# Altium schematic sheet spw_iso.SchDoc
size 209 x 297 mm; SheetNumber: 11; SheetTotal: 12
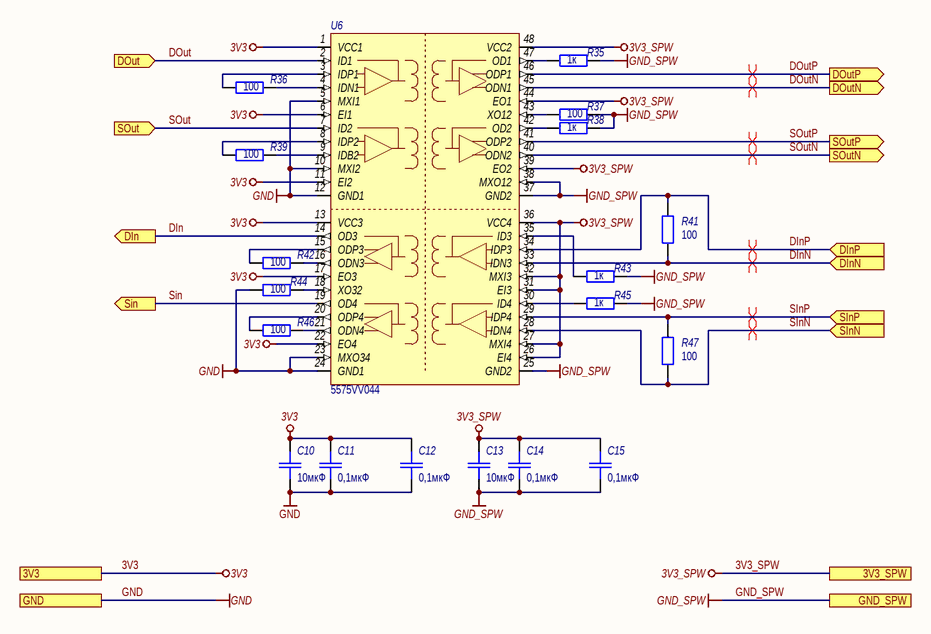
[diagram p0: spw_iso.SchDoc]

## Parts
C10  10мкФ  [SMD_C0805]
C11  0,1мкФ  [SMD_C0805]
C12  0,1мкФ  [SMD_C0805]
C13  10мкФ  [SMD_C0805]
C14  0,1мкФ  [SMD_C0805]
C15  0,1мкФ  [SMD_C0805]
R35  1к  [SMD_0805]
R36  100  [SMD_0805]
R37  100  [SMD_0805]
R38  1к  [SMD_0805]
R39  100  [SMD_0805]
R41  100  [SMD_0805]
R42  100  [SMD_0805]
R43  1к  [SMD_0805]
R44  100  [SMD_0805]
R45  1к  [SMD_0805]
R46  100  [SMD_0805]
R47  100  [SMD_0805]
U6  5575VV044  [MK 4159.48-1]

## Ports
3V3, 3V3_SPW, DIn (out), DInN (in), DInP (in), DOut (in), DOutN (out), DOutP (out), GND, GND_SPW, Sin (out), SInN (in), SInP (in), SOut (in), SOutN (out), SOutP (out)

## Nets
3V3: C10.2 C11.2 C12.2 U6.1(VCC1) U6.6(EI1) U6.11(EI2) U6.13(VCC3) U6.17(EO3) U6.22(EO4) ; port 3V3
3V3_SPW: C13.2 C14.2 C15.2 U6.26(EI4) U6.27(MXI4) U6.31(EI3) U6.32(MXI3) U6.36(VCC4) U6.39(EO2) U6.44(EO1) U6.48(VCC2) ; port 3V3_SPW
GND: C10.1 C11.1 C12.1 R44.2 U6.5(MXI1) U6.10(MXI2) U6.12(GND1) U6.23(MXO34) U6.24(GND1) ; port GND
GND_SPW: C13.1 C14.1 C15.1 R35.2 R37.2 R38.2 R43.2 R45.2 U6.25(GND2) U6.37(GND2) U6.38(MXO12) ; port GND_SPW
DIn: U6.14(OD3) ; port DIn
DInN: R41.1 U6.33(IDN3) ; port DInN
DInP: R41.2 U6.34(IDP3) ; port DInP
DOut: U6.2(ID1) ; port DOut
DOutN: U6.45(ODN1) ; port DOutN
DOutP: U6.46(ODP1) ; port DOutP
Sin: U6.19(OD4) ; port Sin
SInN: R47.1 U6.28(IDN4) ; port SInN
SInP: R47.2 U6.29(IDP4) ; port SInP
SOut: U6.7(ID2) ; port SOut
SOutN: U6.40(ODN2) ; port SOutN
SOutP: U6.41(ODP2) ; port SOutP
NetR35_1: R35.1 U6.47(OD1)
NetR36_1: R36.1 U6.4(IDN1)
NetR36_2: R36.2 U6.3(IDP1)
NetR37_1: R37.1 U6.43(XO12)
NetR38_1: R38.1 U6.42(OD2)
NetR39_1: R39.1 U6.9(IDB2)
NetR39_2: R39.2 U6.8(IDP2)
NetR42_1: R42.1 U6.16(ODN3)
NetR42_2: R42.2 U6.15(ODP3)
NetR43_1: R43.1 U6.35(ID3)
NetR44_1: R44.1 U6.18(XO32)
NetR45_1: R45.1 U6.30(ID4)
NetR46_1: R46.1 U6.21(ODN4)
NetR46_2: R46.2 U6.20(ODP4)

## Layout directives
differential pair: DInN, DInP, DOutN, DOutP, SInN, SInP, SOutN, SOutP

## Notes on the sheet
- Подп. и дата
- Инв. № дубл.
- Взам. инв. №
- Инв. № подл.
- Изм.
- Лист
- № докум.
- Подп.
- Дата
- Форма 2а ГОСТ 2.104-2006
- Копировал
- Формат А4

## Library data of the parts
C10-C15 = Capacitor: Назначение: SMD-конденсатор; Наименование: К10-79 МП0 «ВП»; Потребление, Вт: 0
  C10 C13: Value: 10мкФ
  C11 C12 C14 C15: Value: 0,1мкФ
R35-R39 R41-R47 = Resistor: Наименование: Резистор; Назначение: SMD-резистор; Потребление, Вт: 0,001
  R35 R38 R43 R45: Value: 1к
  R36 R37 R39 R41 R42 R44 R46 R47: Value: 100
U6 = 5575BB044: Микросхема гальванической развязки цифровых сигналов; Потребление, Вт: 0.165; Назначение: Микросхема гальванической развязки цифровых сигналов; Наименование: 5575BB044; ComponentLink1Description: DataSheet; ComponentLink1URL: http://www.asic.ru/images/stories/bmk/5575/5575BB_Opisanie.pdf